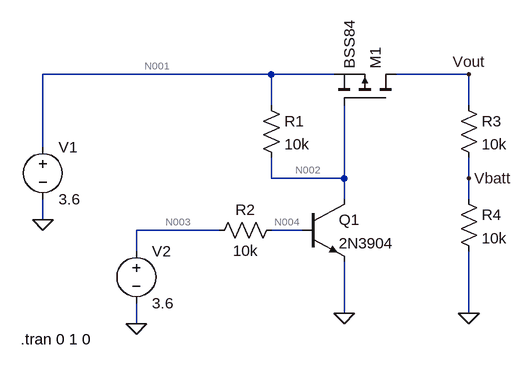
[diagram p0: schematic Draft4.asc]
Draft4.asc, the LTspice schematic file:
Version 4
SHEET 1 880 680
WIRE 176 -16 -176 -16
WIRE 272 -16 176 -16
WIRE 480 -16 368 -16
WIRE 176 32 176 -16
WIRE 480 32 480 -16
WIRE -176 96 -176 -16
WIRE 176 144 176 112
WIRE 288 144 288 32
WIRE 288 144 176 144
WIRE 480 144 480 112
WIRE 288 176 288 144
WIRE 480 176 480 144
WIRE -176 208 -176 176
WIRE 96 224 -32 224
WIRE 224 224 176 224
WIRE -32 256 -32 224
WIRE 288 352 288 272
WIRE 480 352 480 256
WIRE -32 368 -32 336
FLAG -176 208 0
FLAG 288 352 0
FLAG -32 368 0
FLAG 480 352 0
FLAG 480 -16 Vout
FLAG 480 144 Vbatt
SYMBOL voltage -176 80 R0
WINDOW 123 0 0 Left 0
WINDOW 39 0 0 Left 0
SYMATTR InstName V1
SYMATTR Value 3.6
SYMBOL pmos 368 32 M270
SYMATTR InstName M1
SYMATTR Value BSS84
SYMBOL npn 224 176 R0
SYMATTR InstName Q1
SYMATTR Value 2N3904
SYMBOL res 160 16 R0
SYMATTR InstName R1
SYMATTR Value 10k
SYMBOL res 192 208 R90
WINDOW 0 0 56 VBottom 2
WINDOW 3 32 56 VTop 2
SYMATTR InstName R2
SYMATTR Value 10k
SYMBOL res 464 16 R0
SYMATTR InstName R3
SYMATTR Value 10k
SYMBOL res 464 160 R0
SYMATTR InstName R4
SYMATTR Value 10k
SYMBOL voltage -32 240 R0
WINDOW 123 0 0 Left 0
WINDOW 39 0 0 Left 0
SYMATTR InstName V2
SYMATTR Value 3.6
TEXT -210 392 Left 2 !.tran 0 1 0

The netlist it stands for:
* Draft4.asc
V1 N001 0 3.6
M1 Vout N002 N001 N001 BSS84
Q1 N002 N004 0 0 2N3904
R1 N001 N002 10k
R2 N004 N003 10k
R3 Vout Vbatt 10k
R4 Vbatt 0 10k
V2 N003 0 3.6
.model NPN NPN
.model PNP PNP
.lib standard.bjt
.model NMOS NMOS
.model PMOS PMOS
.lib standard.mos
.tran 0 1 0
.backanno
.end

* Results of the author's LTspice run, read from the files saved beside the schematic
* Operating Point, zero values left out:
*   V(n001) = 3.6 V
*   V(vout) = 3.599 V
*   V(n002) = 11.76 mV
*   V(n004) = 676.2 mV
*   V(n003) = 3.6 V
*   V(vbatt) = 1.799 V
*   Ic(Q1) = 358.8 µA
*   Ib(Q1) = 292.4 µA
*   Ie(Q1) = -651.2 µA
*   Id(M1) = -179.9 µA
*   Is(M1) = 179.9 µA
*   I(R1) = 358.8 µA
*   I(R2) = -292.4 µA
*   I(R3) = 179.9 µA
*   I(R4) = 179.9 µA
*   I(V1) = -538.8 µA
*   I(V2) = -292.4 µA